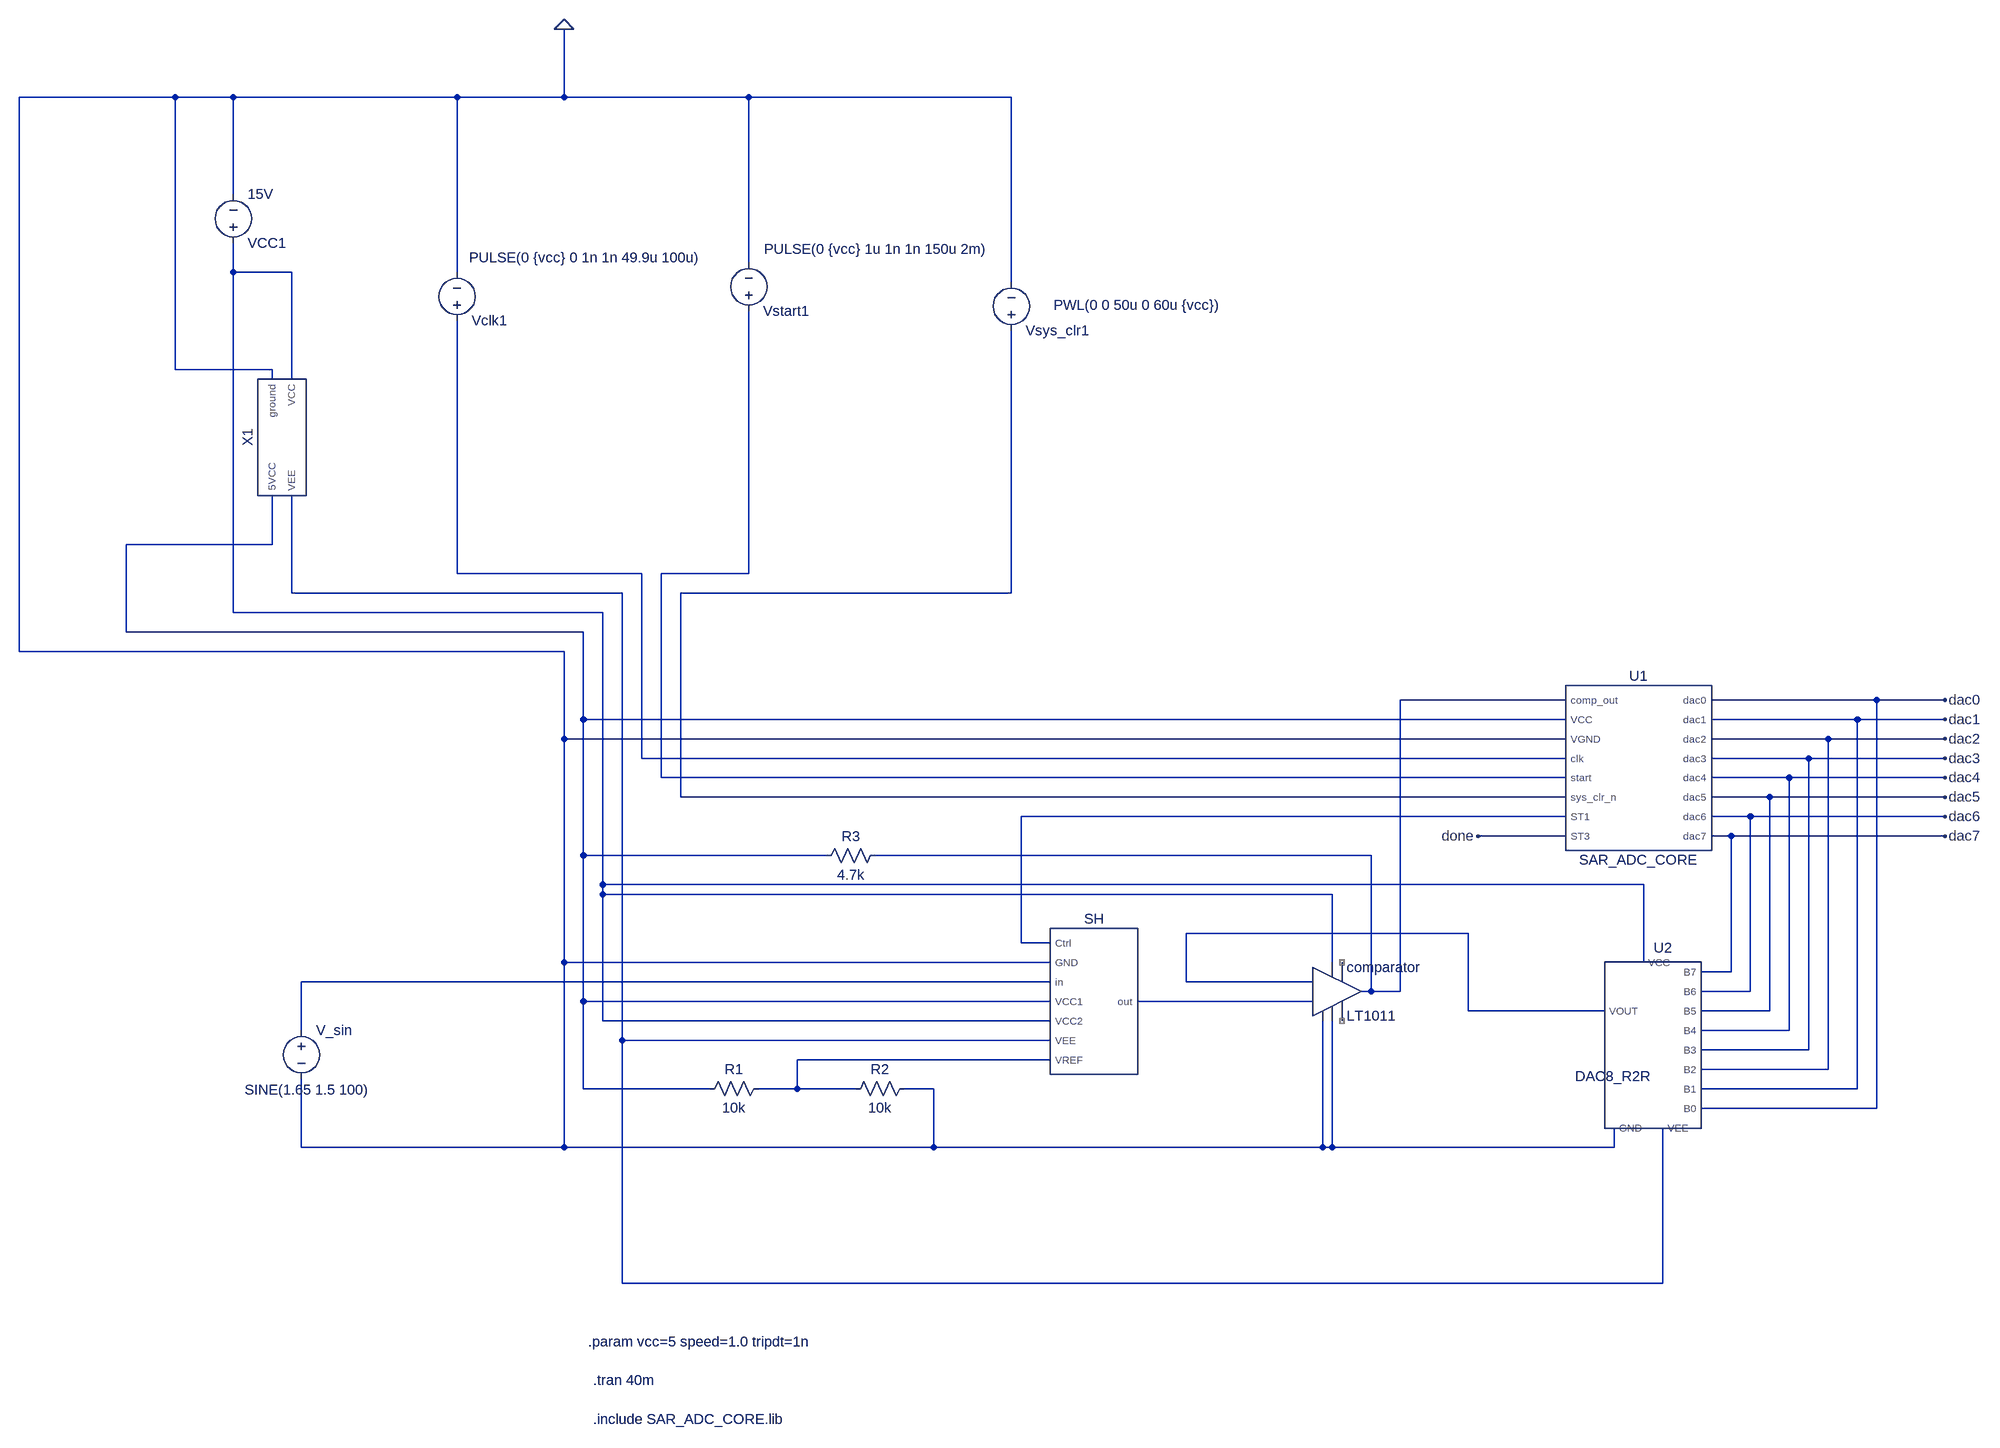
[diagram p0: schematic ADC.asc]
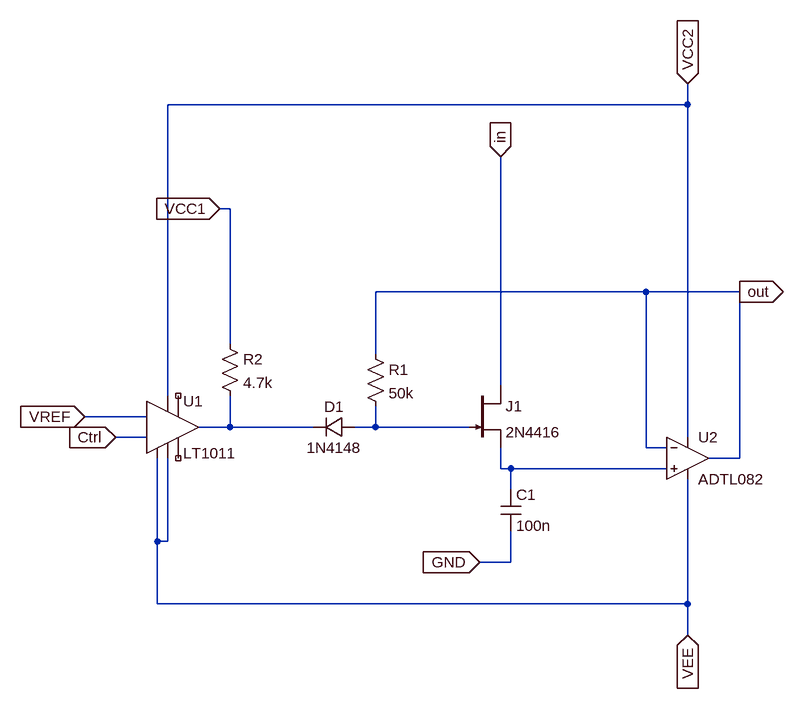
[diagram p1: sub-circuit sh.asc]
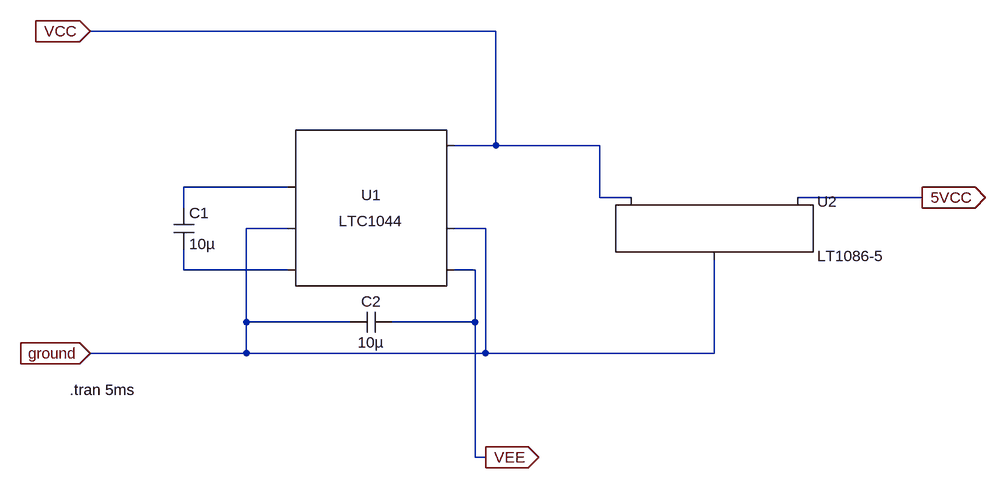
[diagram p2: sub-circuit power_management.asc]
ADC.asc, the LTspice schematic file:
Version 4.1
SHEET 1 3752 932
WIRE -800 -1360 -1056 -1360
WIRE -704 -1360 -800 -1360
WIRE -336 -1360 -704 -1360
WIRE -160 -1360 -160 -1472
WIRE -160 -1360 -336 -1360
WIRE 144 -1360 -160 -1360
WIRE 576 -1360 144 -1360
WIRE -704 -1200 -704 -1360
WIRE 144 -1088 144 -1360
WIRE -704 -1072 -704 -1120
WIRE -608 -1072 -704 -1072
WIRE -336 -1072 -336 -1360
WIRE 576 -1056 576 -1360
WIRE -800 -912 -800 -1360
WIRE -640 -912 -800 -912
WIRE -640 -896 -640 -912
WIRE -608 -896 -608 -1072
WIRE -640 -624 -640 -704
WIRE -640 -624 -880 -624
WIRE -336 -576 -336 -992
WIRE -32 -576 -336 -576
WIRE 144 -576 144 -1008
WIRE 144 -576 0 -576
WIRE -608 -544 -608 -704
WIRE -64 -544 -608 -544
WIRE 576 -544 576 -976
WIRE 576 -544 32 -544
WIRE -704 -512 -704 -1072
WIRE -96 -512 -704 -512
WIRE -880 -480 -880 -624
WIRE -128 -480 -880 -480
WIRE -1056 -448 -1056 -1360
WIRE -160 -448 -1056 -448
WIRE 1488 -368 1216 -368
WIRE 2000 -368 1728 -368
WIRE 2112 -368 2000 -368
WIRE -128 -336 -128 -480
WIRE 1488 -336 -128 -336
WIRE 1968 -336 1728 -336
WIRE 2112 -336 1968 -336
WIRE -160 -304 -160 -448
WIRE 1488 -304 -160 -304
WIRE 1920 -304 1728 -304
WIRE 2112 -304 1920 -304
WIRE -32 -272 -32 -576
WIRE 1488 -272 -32 -272
WIRE 1888 -272 1728 -272
WIRE 2112 -272 1888 -272
WIRE 0 -240 0 -576
WIRE 1488 -240 0 -240
WIRE 1856 -240 1728 -240
WIRE 2112 -240 1856 -240
WIRE 32 -208 32 -544
WIRE 1488 -208 32 -208
WIRE 1824 -208 1728 -208
WIRE 2112 -208 1824 -208
WIRE 1488 -176 592 -176
WIRE 1792 -176 1728 -176
WIRE 2112 -176 1792 -176
WIRE 1488 -144 1344 -144
WIRE 1760 -144 1728 -144
WIRE 2112 -144 1760 -144
WIRE -128 -112 -128 -336
WIRE 272 -112 -128 -112
WIRE 1168 -112 352 -112
WIRE -96 -64 -96 -512
WIRE 1616 -64 -96 -64
WIRE -96 -48 -96 -64
WIRE 1104 -48 -96 -48
WIRE 1328 16 864 16
WIRE 592 32 592 -176
WIRE 640 32 592 32
WIRE -160 64 -160 -304
WIRE 640 64 -160 64
WIRE 1104 64 1104 -48
WIRE 1616 64 1616 -64
WIRE 1760 80 1760 -144
WIRE 1760 80 1712 80
WIRE 640 96 -592 96
WIRE 864 96 864 16
WIRE 1072 96 864 96
WIRE 1168 112 1168 -112
WIRE 1168 112 1152 112
WIRE 1216 112 1216 -368
WIRE 1216 112 1168 112
WIRE 1792 112 1792 -176
WIRE 1792 112 1712 112
WIRE -128 128 -128 -112
WIRE 640 128 -128 128
WIRE 1072 128 784 128
WIRE 1328 144 1328 16
WIRE 1552 144 1328 144
WIRE 1824 144 1824 -208
WIRE 1824 144 1712 144
WIRE -96 160 -96 -48
WIRE 640 160 -96 160
WIRE -592 176 -592 96
WIRE 1856 176 1856 -240
WIRE 1856 176 1712 176
WIRE -64 192 -64 -544
WIRE 640 192 -64 192
WIRE 1888 208 1888 -272
WIRE 1888 208 1712 208
WIRE 640 224 224 224
WIRE 1920 240 1920 -304
WIRE 1920 240 1712 240
WIRE -128 272 -128 128
WIRE 80 272 -128 272
WIRE 224 272 224 224
WIRE 224 272 160 272
WIRE 320 272 224 272
WIRE 448 272 400 272
WIRE 1968 272 1968 -336
WIRE 1968 272 1712 272
WIRE 2000 304 2000 -368
WIRE 2000 304 1712 304
WIRE -592 368 -592 256
WIRE -160 368 -160 64
WIRE -160 368 -592 368
WIRE 448 368 448 272
WIRE 448 368 -160 368
WIRE 1088 368 1088 160
WIRE 1088 368 448 368
WIRE 1104 368 1104 160
WIRE 1104 368 1088 368
WIRE 1568 368 1568 336
WIRE 1568 368 1104 368
WIRE -64 592 -64 192
WIRE 1648 592 1648 336
WIRE 1648 592 -64 592
FLAG 2112 -368 dac0
FLAG 2112 -336 dac1
FLAG 2112 -304 dac2
FLAG 2112 -272 dac3
FLAG 2112 -240 dac4
FLAG 2112 -208 dac5
FLAG 2112 -176 dac6
FLAG 2112 -144 dac7
FLAG 1344 -144 done
FLAG -160 -1472 0
SYMBOL voltage -592 160 R0
WINDOW 123 0 0 Left 0
WINDOW 39 0 0 Left 0
WINDOW 3 -93 114 Left 2
SYMATTR Value SINE(1.65 1.5 100)
SYMATTR InstName V_sin
SYMBOL SAR_ADC_CORE 1600 -256 R0
SYMATTR InstName U1
SYMBOL DAC8_R2R 1648 160 M0
SYMATTR InstName U2
SYMBOL Comparators\\LT1011 1104 112 R0
SYMATTR InstName comparator
SYMBOL res 176 256 R90
WINDOW 0 0 56 VBottom 2
WINDOW 3 32 56 VTop 2
SYMATTR InstName R1
SYMATTR Value 10k
SYMBOL res 416 256 R90
WINDOW 0 0 56 VBottom 2
WINDOW 3 32 56 VTop 2
SYMATTR InstName R2
SYMATTR Value 10k
SYMBOL voltage -704 -1104 M180
WINDOW 123 0 0 Left 0
WINDOW 39 0 0 Left 0
SYMATTR InstName VCC1
SYMATTR Value 15V
SYMBOL voltage -336 -976 M180
WINDOW 3 20 120 Left 2
WINDOW 123 0 0 Left 0
WINDOW 39 0 0 Left 0
SYMATTR Value PULSE(0 {vcc} 0 1n 1n 49.9u 100u)
SYMATTR InstName Vclk1
SYMBOL voltage 576 -960 M180
WINDOW 3 70 58 Left 2
WINDOW 123 0 0 Left 0
WINDOW 39 0 0 Left 0
SYMATTR Value PWL(0 0 50u 0 60u {vcc})
SYMATTR InstName Vsys_clr1
SYMBOL voltage 144 -992 M180
WINDOW 3 25 118 Left 2
WINDOW 123 0 0 Left 0
WINDOW 39 0 0 Left 0
SYMATTR Value PULSE(0 {vcc} 1u 1n 1n 150u 2m)
SYMATTR InstName Vstart1
SYMBOL SH 704 128 R0
SYMATTR InstName SH
SYMBOL res 368 -128 R90
WINDOW 0 0 56 VBottom 2
WINDOW 3 32 56 VTop 2
SYMATTR InstName R3
SYMATTR Value 4.7k
SYMBOL power_management -624 -800 M90
SYMATTR InstName X1
TEXT -120 688 Left 2 !.param vcc=5 speed=1.0 tripdt=1n
TEXT -112 752 Left 2 !.tran 40m
TEXT -112 816 Left 2 !.include SAR_ADC_CORE.lib

sh.asc, the sub-circuit schematic file:
Version 4.1
SHEET 1 880 680
WIRE 608 -272 608 -304
WIRE 608 -272 -192 -272
WIRE -96 -112 -112 -112
WIRE 544 16 128 16
WIRE 688 16 544 16
WIRE -96 96 -96 -112
WIRE 128 112 128 16
WIRE 320 160 320 -192
WIRE -192 176 -192 -272
WIRE -224 208 -320 208
WIRE -96 224 -96 176
WIRE -96 224 -144 224
WIRE 32 224 -96 224
WIRE 128 224 128 192
WIRE 128 224 96 224
WIRE 272 224 128 224
WIRE -224 240 -272 240
WIRE 608 240 608 -272
WIRE 544 256 544 16
WIRE 576 256 544 256
WIRE 688 272 688 16
WIRE 688 272 640 272
WIRE 320 288 320 256
WIRE 336 288 320 288
WIRE 576 288 336 288
WIRE 336 320 336 288
WIRE -208 400 -208 272
WIRE -192 400 -192 272
WIRE -192 400 -208 400
WIRE 336 432 336 384
WIRE 336 432 288 432
WIRE -208 496 -208 400
WIRE 608 496 608 304
WIRE 608 496 -208 496
WIRE 608 544 608 496
FLAG 608 544 VEE
IOPIN 608 544 In
FLAG -272 240 Ctrl
IOPIN -272 240 In
FLAG -320 208 VREF
IOPIN -320 208 In
FLAG 288 432 GND
IOPIN 288 432 In
FLAG 608 -304 VCC2
IOPIN 608 -304 In
FLAG -112 -112 VCC1
IOPIN -112 -112 In
FLAG 688 16 out
IOPIN 688 16 Out
FLAG 320 -192 in
IOPIN 320 -192 In
SYMBOL res 112 96 R0
SYMATTR InstName R1
SYMATTR Value 50k
SYMBOL diode 96 240 M270
WINDOW 0 32 32 VTop 2
WINDOW 3 0 32 VBottom 2
SYMATTR InstName D1
SYMATTR Value 1N4148
SYMBOL Comparators\\LT1011 -192 224 R0
SYMATTR InstName U1
SYMBOL res -112 80 R0
SYMATTR InstName R2
SYMATTR Value 4.7k
SYMBOL OpAmps\\ADTL082 608 208 R0
SYMATTR InstName U2
SYMBOL njf 272 160 R0
SYMATTR InstName J1
SYMATTR Value 2N4416
SYMBOL cap 320 320 R0
SYMATTR InstName C1
SYMATTR Value 100n

power_management.asc, the sub-circuit schematic file:
Version 4.1
SHEET 1 1032 680
WIRE 256 -176 -368 -176
WIRE 256 0 256 -176
WIRE 256 0 192 0
WIRE 416 0 256 0
WIRE -64 64 -224 64
WIRE 416 80 416 0
WIRE 464 80 416 80
WIRE 912 80 720 80
WIRE -224 96 -224 64
WIRE -64 128 -128 128
WIRE 240 128 192 128
WIRE -224 192 -224 160
WIRE -64 192 -224 192
WIRE 224 192 192 192
WIRE -128 272 -128 128
WIRE 32 272 -128 272
WIRE 224 272 224 192
WIRE 224 272 96 272
WIRE -128 320 -128 272
WIRE -128 320 -368 320
WIRE 240 320 240 128
WIRE 240 320 -128 320
WIRE 592 320 592 176
WIRE 592 320 240 320
WIRE 224 480 224 272
WIRE 240 480 224 480
FLAG -368 320 ground
IOPIN -368 320 In
FLAG -368 -176 VCC
IOPIN -368 -176 In
FLAG 240 480 VEE
IOPIN 240 480 Out
FLAG 912 80 5VCC
IOPIN 912 80 Out
SYMBOL PowerProducts\\LTC1044 64 96 R0
SYMATTR InstName U1
SYMBOL PowerProducts\\LT1086-5 592 80 R0
SYMATTR InstName U2
SYMBOL cap -240 96 R0
SYMATTR InstName C1
SYMATTR Value 10µ
SYMATTR SpiceLine Rser=0.1
SYMBOL cap 96 256 R90
WINDOW 0 0 32 VBottom 2
WINDOW 3 32 32 VTop 2
SYMATTR InstName C2
SYMATTR Value 10µ
SYMATTR SpiceLine Rser=0.1
TEXT -400 376 Left 2 !.tran 5ms

The netlist it stands for:
* ADC.asc
V_sin N010 0 SINE(1.65 1.5 100)
X§U1 N007 N002 0 N003 N004 N006 N008 done dac0 dac1 dac2 dac3 dac4 dac5 dac6 dac7 SAR_ADC_CORE  ; pins comp_out VCC VGND clk start sys_clr_n ST1 ST3 dac0 dac1 dac2 dac3 dac4 dac5 dac6 dac7
X§U2 dac7 dac6 dac5 dac4 dac3 dac2 dac1 dac0 N001 N005 0 N009 DAC8_R2R  ; pins B7 B6 B5 B4 B3 B2 B1 B0 VCC VEE GND VOUT
X§comparator 0 N011 N009 0 NC_01 NC_02 N007 N001 LT1011
R1 N012 N002 10k
R2 0 N012 10k
VCC1 N001 0 15V
Vclk1 N003 0 PULSE(0 {vcc} 0 1n 1n 49.9u 100u)
Vsys_clr1 N006 0 PWL(0 0 50u 0 60u {vcc})
Vstart1 N004 0 PULSE(0 {vcc} 1u 1n 1n 150u 2m)
X§SH N008 0 N010 N002 N001 N005 N012 N011 sh
R3 N007 N002 4.7k
X§X1 0 N001 N002 N005 power_management

* block symbol definitions
.subckt sh Ctrl GND in VCC1 VCC2 VEE VREF out
R1 out N002 50k
D1 N002 N001 1N4148
X§U1 VEE Ctrl VREF VEE NC_01 NC_02 N001 VCC2 LT1011
R2 VCC1 N001 4.7k
X§U2 N003 out VCC2 VEE out ADTL082  ; pins In+ In- V+ V- OUT
J1 in N002 N003 2N4416
C1 N003 GND 100n
.ends sh

.subckt power_management ground VCC 5VCC VEE
X§U1 NC_01 N001 ground N002 VEE ground NC_02 VCC LTC1044
X§U2 ground 5VCC VCC LT1086-5
C1 N001 N002 10µ Rser=0.1
C2 VEE ground 10µ Rser=0.1
.tran 5ms
.ends power_management

.model D D
.lib standard.dio
.model NJF NJF
.model PJF PJF
.lib standard.jft
.param vcc=5 speed=1.0 tripdt=1n
.tran 40m
.include SAR_ADC_CORE.lib
.lib D:\Project Folders\LTspice_Repos\ADC\dac\DAC8_R2R.lib
.lib LTC1.lib
.lib ADI.lib
.lib LTC1044.sub
.backanno
.end